# EAGLE schematic InductionHeater (EAGLE 6.4)
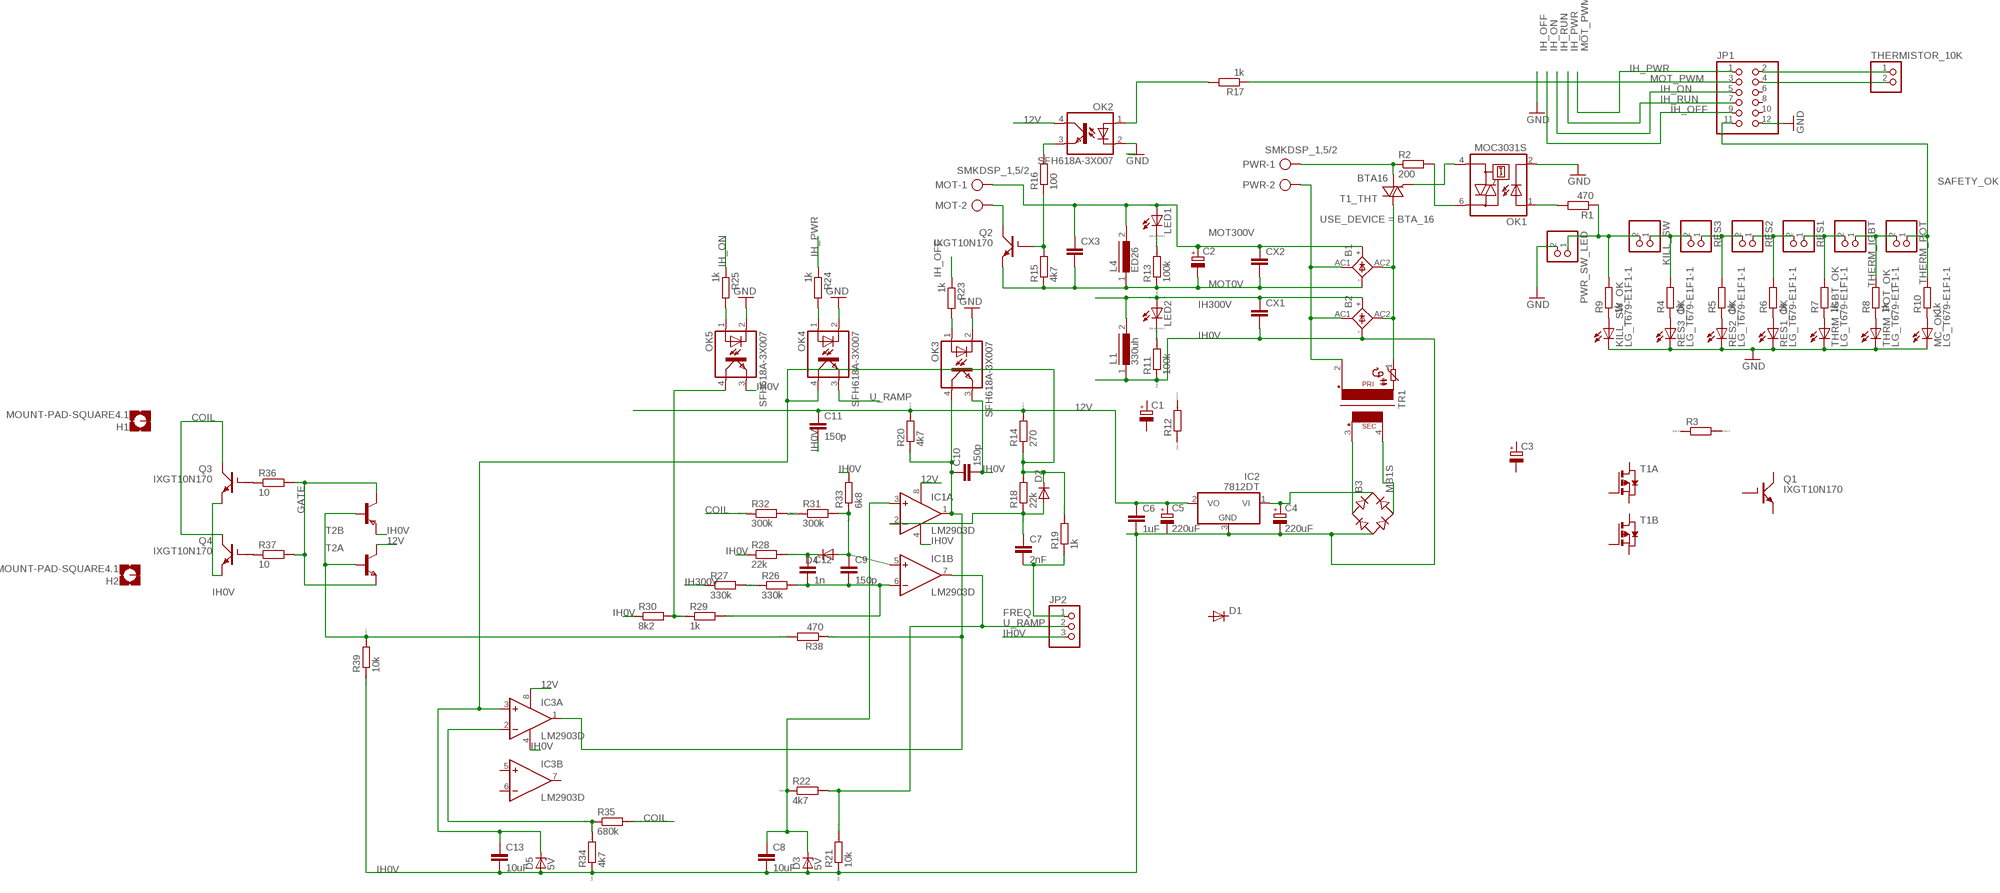
[diagram p0: schematic, sheet 1]

## Parts
B1  FB15  [FB15]
B2  FB15  [FB15]
B3  MB1S  [SOIC-4]
C1  CPOL-EUB45181D  [B45181D]
C2  CPOL-EUB45181D  [B45181D]
C3  CPOL-EUE3.5-10  [E3,5-10]
C4  220uF  CPOL-EUE3.5-10  [E3,5-10]
C5  220uF  CPOL-EUE3.5-10  [E3,5-10]
C6  1uF  C-EUC0603  [C0603]
C7  2nF  C-EUC0603  [C0603]
C8  10uF  C-EUC0603  [C0603]
C9  150p  C-EUC0603  [C0603]
C10  150p  C-EUC0603  [C0603]
C11  150p  C-EUC0603  [C0603]
C12  1n  C-EUC0603  [C0603]
C13  10uF  C-EUC0603  [C0603]
CX1  CXXC15B6  [XC15B6]
CX2  CXXC15B6  [XC15B6]
CX3  CXXC15B6  [XC15B6]
D1  DIODE-SOD123  [SOD123]
D2  DIODE-SOD123  [SOD123]
D3  5V  ZENER-DIODESMB  [SMB]
D4  DIODE-SOD123  [SOD123]
D5  5V  ZENER-DIODESMB  [SMB]
H1  MOUNT-PAD-SQUARE4.1  [4,1-PAD-SQUARE]
H2  MOUNT-PAD-SQUARE4.1  [4,1-PAD-SQUARE]
IC1  LM2903D  [SO08]
IC2  7812DT  [TO252]
IC3  LM2903D  [SO08]
JP1  PINHD-2X6  [2X06]
JP2  PINHD-1X3  [1X03]
KILL_SW  PINHD-1X2  [1X02]
KILL_SW_OK  LG_T679-E1F1-1  [PLCC2]
L1  330uh  ED43  [ED43]
L4  ED26  [ED26]
LED1  LED_E  [LED_1206]
LED2  LED_E  [LED_1206]
MC_OK  LG_T679-E1F1-1  [PLCC2]
MOT  SMKDSP_1,5/2  [SMKDSP_1,5/2]
OK1  MOC3031S  [DIL6-SMD]
OK2  SFH618A-3X007  [SMD4-7]
OK3  SFH618A-3X007  [SMD4-7]
OK4  SFH618A-3X007  [SMD4-7]
OK5  SFH618A-3X007  [SMD4-7]
PWR  SMKDSP_1,5/2  [SMKDSP_1,5/2]
PWR_SW_LED  PINHD-1X2  [1X02]
Q1  IXGT10N170  [TO268]
Q2  IXGT10N170  [TO268]
Q3  IXGT10N170  [TO268]
Q4  IXGT10N170  [TO268]
R1  470  R-EU_M0805  [M0805]
R2  200  R-EU_M0805  [M0805]
R3  R0207/10  [0207/10]
R4  1k  R-EU_M0805  [M0805]
R5  1k  R-EU_M0805  [M0805]
R6  1k  R-EU_M0805  [M0805]
R7  1k  R-EU_M0805  [M0805]
R8  1k  R-EU_M0805  [M0805]
R9  1k  R-EU_M0805  [M0805]
R10  1k  R-EU_M0805  [M0805]
R11  100k  RR1206  [R1206]
R12  RR1206  [R1206]
R13  100k  RR1206  [R1206]
R14  270  RR1206  [R1206]
R15  4k7  R-EU_M0805  [M0805]
R16  100  R-EU_M0805  [M0805]
R17  1k  R-EU_M0805  [M0805]
R18  22k  RR1206  [R1206]
R19  1k  RR1206  [R1206]
R20  4k7  RR1206  [R1206]
R21  10k  RR1206  [R1206]
R22  4k7  RR1206  [R1206]
R23  1k  R-EU_M0805  [M0805]
R24  1k  R-EU_M0805  [M0805]
R25  1k  R-EU_M0805  [M0805]
R26  330k  RR1206  [R1206]
R27  330k  RR1206  [R1206]
R28  22k  RR1206  [R1206]
R29  1k  RR1206  [R1206]
R30  8k2  RR1206  [R1206]
R31  300k  RR1206  [R1206]
R32  300k  RR1206  [R1206]
R33  6k8  RR1206  [R1206]
R34  4k7  RR1206  [R1206]
R35  680k  RR1206  [R1206]
R36  10  RR1206  [R1206]
R37  10  RR1206  [R1206]
R38  470  RR1206  [R1206]
R39  10k  RR1206  [R1206]
RES1  PINHD-1X2  [1X02]
RES1_OK  LG_T679-E1F1-1  [PLCC2]
RES2  PINHD-1X2  [1X02]
RES2_OK  LG_T679-E1F1-1  [PLCC2]
RES3  PINHD-1X2  [1X02]
RES3_OK  LG_T679-E1F1-1  [PLCC2]
T1  PN_MOSFET-SO8  [SO8]
T1_THT  BTA16  BT138-V  [TO220BV]
T2  NPN_PNPSM8  [SM8]
THERM_IGBT  PINHD-1X2  [1X02]
THERM_POT  PINHD-1X2  [1X02]
THERMISTOR_10K  PINHD-1X2  [1X02]
THRM_IGBT_OK  LG_T679-E1F1-1  [PLCC2]
THRM_POT_OK  LG_T679-E1F1-1  [PLCC2]
TR1  PT13-1  [PT13-1]

## Nets
3V3: JP1.4 THERMISTOR_10K.2
12V: C5.+ C6.1 C11.1 IC1.8(P:V+) IC2.2(VO) IC3.8(P:V+) OK2.4(COL) R14.2 R20.2
15V: B3.+ C4.+ IC2.1(VI)
COIL: R32.1
FREQ: C7.2 JP2.1 R19.1
GATE: R36.2 R37.2 T2.3(B:E) T2.7(A:C) T2.8(A:C)
GND: JP1.12 KILL_SW_OK.C MC_OK.C OK1.2(C) OK2.2(C) OK3.2(C) OK4.2(C) OK5.2(C) PWR_SW_LED.2 RES1_OK.C RES2_OK.C RES3_OK.C THRM_IGBT_OK.C THRM_POT_OK.C
IH0V: B2.- B3.- C4.- C6.2 C8.2 C10.2 C13.2 CX1.2 D3.A D5.A IC1.4(P:V-) IC2.3(GND) IC3.4(P:V-) L1.1 OK3.3(EMIT) R11.1 R21.1 R34.1 R39.1
IH300V: B2.+ CX1.1 L1.2 LED2.A R27.1
IH_OFF: JP1.9 R23.1
IH_ON: JP1.5 R25.1
IH_PWR: JP1.1 R24.1
IH_RUN: JP1.7
IH_THERMISTOR: JP1.2 THERMISTOR_10K.1
L_IN: PWR.1 R2.1 T1_THT.T1(A1)
L_OUT: B1.AC2 B2.AC2 T1_THT.T2(A2) TR1.1
MOT0V: B1.- C2.- CX2.2 CX3.2 L4.1 Q2.E R13.1 R15.1
MOT300V: B1.+ C2.+ CX2.1 CX3.1 L4.2 LED1.A MOT.1
MOT_PWM: JP1.3 R17.1
N$1: OK1.1(A) R1.2
N$2: OK1.6(A2) R2.2
N$3: R8.2 THERM_IGBT.1 THERM_POT.2
N$4: R7.2 RES1.1 THERM_IGBT.2
N$5: R6.2 RES1.2 RES2.1
N$6: R5.2 RES2.2 RES3.1
N$7: KILL_SW.1 R4.2 RES3.2
N$8: KILL_SW.2 PWR_SW_LED.1 R1.1 R9.2
N$9: R4.1 RES3_OK.A
N$10: R5.1 RES2_OK.A
N$11: R6.1 RES1_OK.A
N$12: R7.1 THRM_IGBT_OK.A
N$13: R8.1 THRM_POT_OK.A
N$14: MC_OK.A R10.1
N$15: KILL_SW_OK.A R9.1
N$16: LED2.C R11.2
N$17: LED1.C R13.2
N$18: B3.~1(AC1) TR1.3
N$19: B3.~2(AC2) TR1.4
N$20: MOT.2 Q2.C@1(C) Q2.C@2(C)
N$21: OK2.3(EMIT) R16.2
N$22: Q2.G R15.2 R16.1
N$23: OK2.1(A) R17.2
N$24: C8.1 D3.C IC1.3(A:+IN) R22.1
N$25: C7.1 D2.A IC1.2(A:-IN) R18.1
N$26: OK3.1(A) R23.2
N$27: C13.1 D2.C D5.C IC3.3(A:+IN) OK4.4(COL) R14.1 R18.2 R19.2
N$28: C10.1 IC1.1(A:OUT) IC3.1(A:OUT) OK3.4(COL) R20.1 R38.1
N$29: OK4.1(A) R24.2
N$30: OK5.1(A) R25.2
N$31: C9.2 C12.2 IC1.6(B:-IN) R26.2 R29.2
N$32: R26.1 R27.2
N$33: C12.1 D4.C R28.2
N$34: C9.1 D4.A IC1.5(B:+IN) R31.2 R33.1
N$35: OK5.4(COL) R29.1 R30.2
N$36: R31.1 R32.2
N$37: Q3.G R36.1
N$38: IC3.2(A:-IN) R34.2 R35.1
N$39: Q4.G R37.1
N$40: R38.2 R39.2 T2.2(A:B) T2.4(B:B)
PWR_N: B1.AC1 B2.AC1 PWR.2 TR1.2
SAFETY_OK: JP1.11 R10.2 THERM_POT.1
TRIAC_DRV: OK1.4(A1) T1_THT.G
U_RAMP: IC1.7(B:OUT) JP2.2 OK4.3(EMIT) R21.2 R22.2
Unconnected: C1.+ C1.- C3.+ C3.- C5.- C11.2 D1.A D1.C H1.B4,1(MOUNT) H2.B4,1(MOUNT) IC3.5(B:+IN) IC3.6(B:-IN) IC3.7(B:OUT) JP1.6 JP1.8 JP1.10 JP2.3 OK5.3(EMIT) Q1.C@1(C) Q1.C@2(C) Q1.E Q1.G Q3.C@1(C) Q3.C@2(C) Q3.E Q4.C@1(C) Q4.C@2(C) Q4.E R3.1 R3.2 R12.1 R12.2 R28.1 R30.1 R33.2 R35.2 T1.1(A:S) T1.2(A:G) T1.3(B:S) T1.4(B:G) T1.5(B:D) T1.6(B:D) T1.7(A:D) T1.8(A:D) T2.1(A:E) T2.5(B:C) T2.6(B:C)

## Library data of the parts
B1 B2 = rectifier:FB15: FAGOR RECTIFIER grid 3 x 5 mm
B3 = rectifier:MB*S: Bridge Rectifier Source: http://www.fairchildsemi.com/ds/MB/MB6S.pdf
C1 C2 = resistor:CPOL-EU: POLARIZED CAPACITOR, European symbol
C3-C5 = rcl:CPOL-EU: POLARIZED CAPACITOR, European symbol
C6-C13 = rcl:C-EU: CAPACITOR, European symbol
CX1-CX3 = rcl:CX: X CAPACITOR for power line
D1 D2 D4 = diode:DIODE-: DIODE
D3 D5 = diode:ZENER-DIODE: Z-Diode
H1 H2 = holes:MOUNT-PAD-SQUARE: MOUNTING PAD, square
IC1 IC3 = linear:LM2903: COMPARATOR
IC2 = linear:78*: Positive VOLTAGE REGULATOR Source: http://cache.national.com/ds/LM/LM78L05.pdf http://www.fairchildsemi.com/ds/LM/LM7805.pdf
JP1 = pinhead:PINHD-2X6: PIN HEADER
JP2 = pinhead:PINHD-1X3: PIN HEADER
KILL_SW PWR_SW_LED RES1-RES3 THERM_IGBT THERM_POT THERMISTOR_10K = pinhead:PINHD-1X2: PIN HEADER
KILL_SW_OK MC_OK RES1_OK RES2_OK RES3_OK THRM_IGBT_OK THRM_POT_OK = led:*_T679-?-1: LC TOPLED® Low Current LED Source: http://catalog.osram-os.com .. LG_LS_LY_T679_OBS.pdf; COLOR: green
L1 = inductors:ED43: INDUCTOR
L4 = inductors:ED26: INDUCTOR
LED1 LED2 = eagle-ltspice:LED_E: LED Source: http://www.osram.convergy.de Source: www.luxeon.com Source: www.kingbright.com; SPICEMODEL: NONE; SPICEPREFIX: D; SPICETYPE: diode
MOT PWR = con-phoenix-smkdsp:SMKDSP_1,5/2: Printklemme, Nennstrom: 17,5 A, Bemessungsspannung: 250 V, Raster: 5,0 mm Source: http://eshop.phoenixcontact.de .. 1733415.pdf; MF: FARNELL; MPN: 1733570; OC_FARNELL: 3041244; OC_NEWARK: 69C8588
OK1 = optocoupler:MOC30*: 6-Pin DIP Zero-Cross Optoisolators Triac Driver Output (250/400 Volt Peak) Source: http://www.fairchildsemi.com/ds/MO/MOC3043-M.pdf; MF: FAIRCHILD SEMICONDUCTOR; MPN: MOC3031SM; OC_FARNELL: unknown; OC_NEWARK: 34C1335
OK2-OK5 = optocoupler:SFH618?*: Optocoupler, Phototransistor Output, Low Input Current Source: Data sheet <http://www.vishay.com/docs/83673/sfh618.pdf>; OC_FARNELL: unknown; OC_NEWARK: unknown
Q1-Q4 = transistor-power:IXG?*N170: High Voltage IGBT Source: http://www.ixys.com/98989.pdf
R1 R2 R4-R10 R15-R17 R23-R25 = rcl:R-EU_: RESISTOR, European symbol
R3 R11-R14 R18-R22 R26-R39 = eagle-ltspice:R: RESISTOR, European symbol; SPICEMODEL: NONE; SPICEPREFIX: R
T1 = zetex:PN_MOSFET-: DUAL N AND P-CHANNEL ENHANCEMENT MODE MOSFET source ZXMD63C02.pdf from http://www.zetex.com/; OC_FARNELL: unknown; OC_NEWARK: unknown
T1_THT = triac:BT138: TRIAC Source: http://www.semiconductors.philips.com BT138_SERIES_2.pdf; USE_DEVICE: BTA_16
T2 = zetex:NPN_PNPSM8: Dual NPN TRANSISTOR; OC_FARNELL: unknown; OC_NEWARK: unknown
TR1 = trafo:PT13-1: TRANSFORMER 1 primary winding, temp. protection fuse, 1 secondary winding, mounting holes BLOCK